# Altium project BTL_HW_V1.0.0.PrjPcb
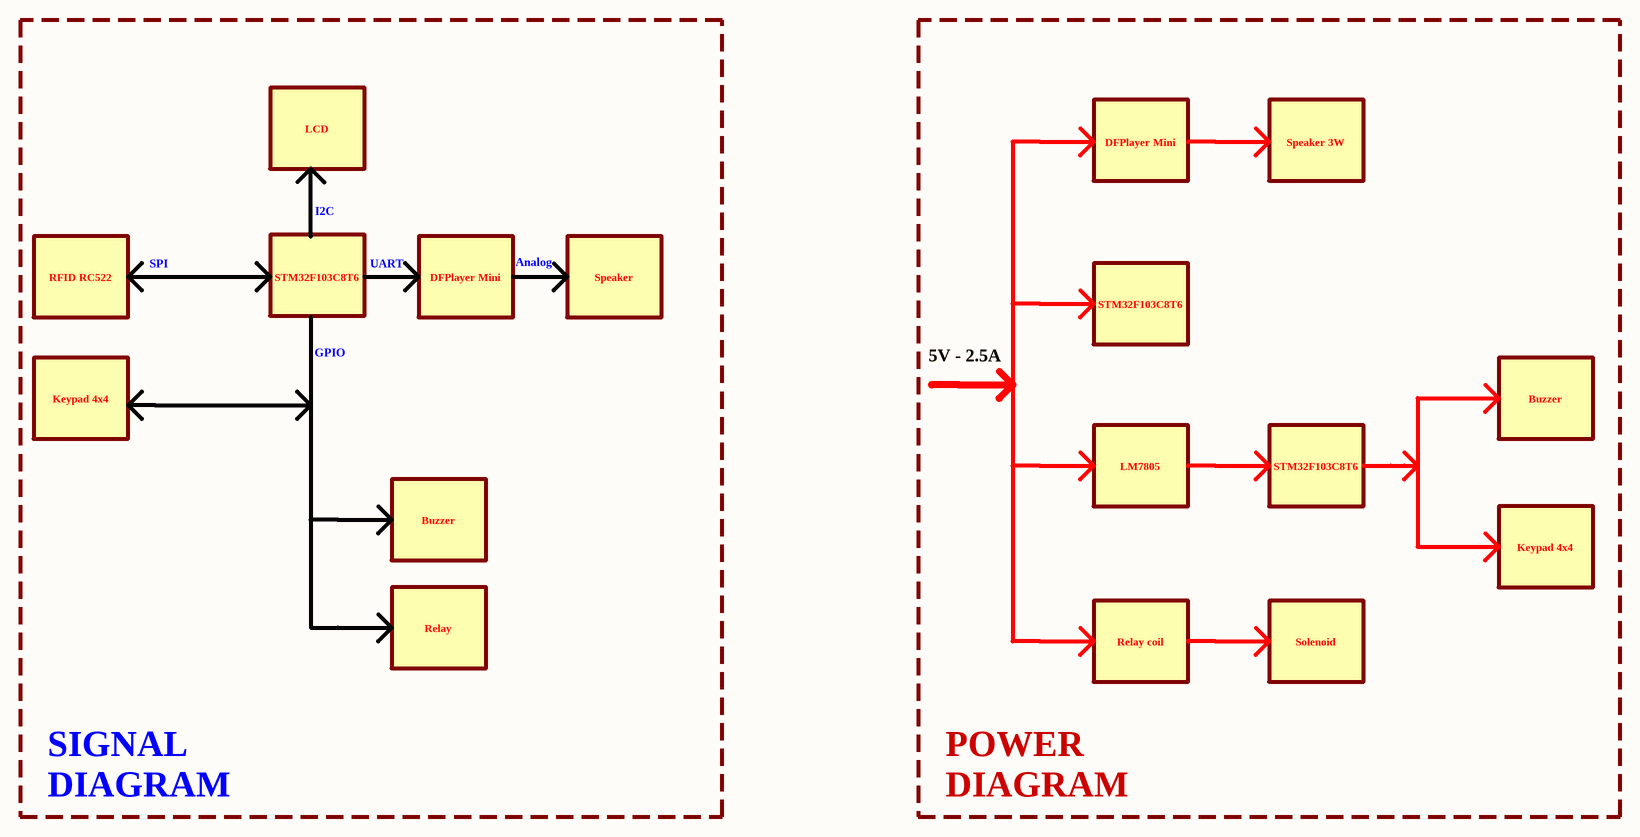
[diagram p0: Block_Diagram.SchDoc]
6 sheets, 61 parts. Net scope: flat (ports and power ports of the same name join across sheets).
Board file: HW_V1.0.0.PcbDoc
Sheets:
  Block_Diagram.SchDoc
  MCU.SchDoc
  RFID.SchDoc
  Relay.SchDoc
  POWER.SchDoc
  LCD.SchDoc

## Sheet Block_Diagram.SchDoc: Block_Diagram
size 420 x 297 mm; DrawnBy: Linh Vu; SheetNumber: 1; SheetTotal: 6; MasterProject: BTL_TKHTN

### Notes on the sheet
- LCD
- 620mA
- 5V
- DFPlayer Mini
- 600mA
- Speaker 3W
- I2C
- RFID RC522
- SPI
- STM32F103C8T6
- UART
- Analog
- Speaker
- GPIO
- 30mA
- Keypad 4x4
- 5V - 2.5A
- 3V3
- 2mA
- Buzzer
- 45mA
- LM7805
- 6mA
- Relay
- 1300mA
- Relay coil
- 1000mA
- Solenoid
- SIGNAL
  DIAGRAM
- POWER
  DIAGRAM
- Sub-system:
- Project:
- Design by:
- Sheet title:
- Sheet
- of
- Checked by:
- Approved by:
- Doc No:
- Revision:
- Size:
- Date:
- A3

## Sheet MCU.SchDoc: MCU
size 420 x 297 mm; DrawnBy: Hung Vo; SheetNumber: 2; SheetTotal: 6; MasterProject: BTL TKHTN
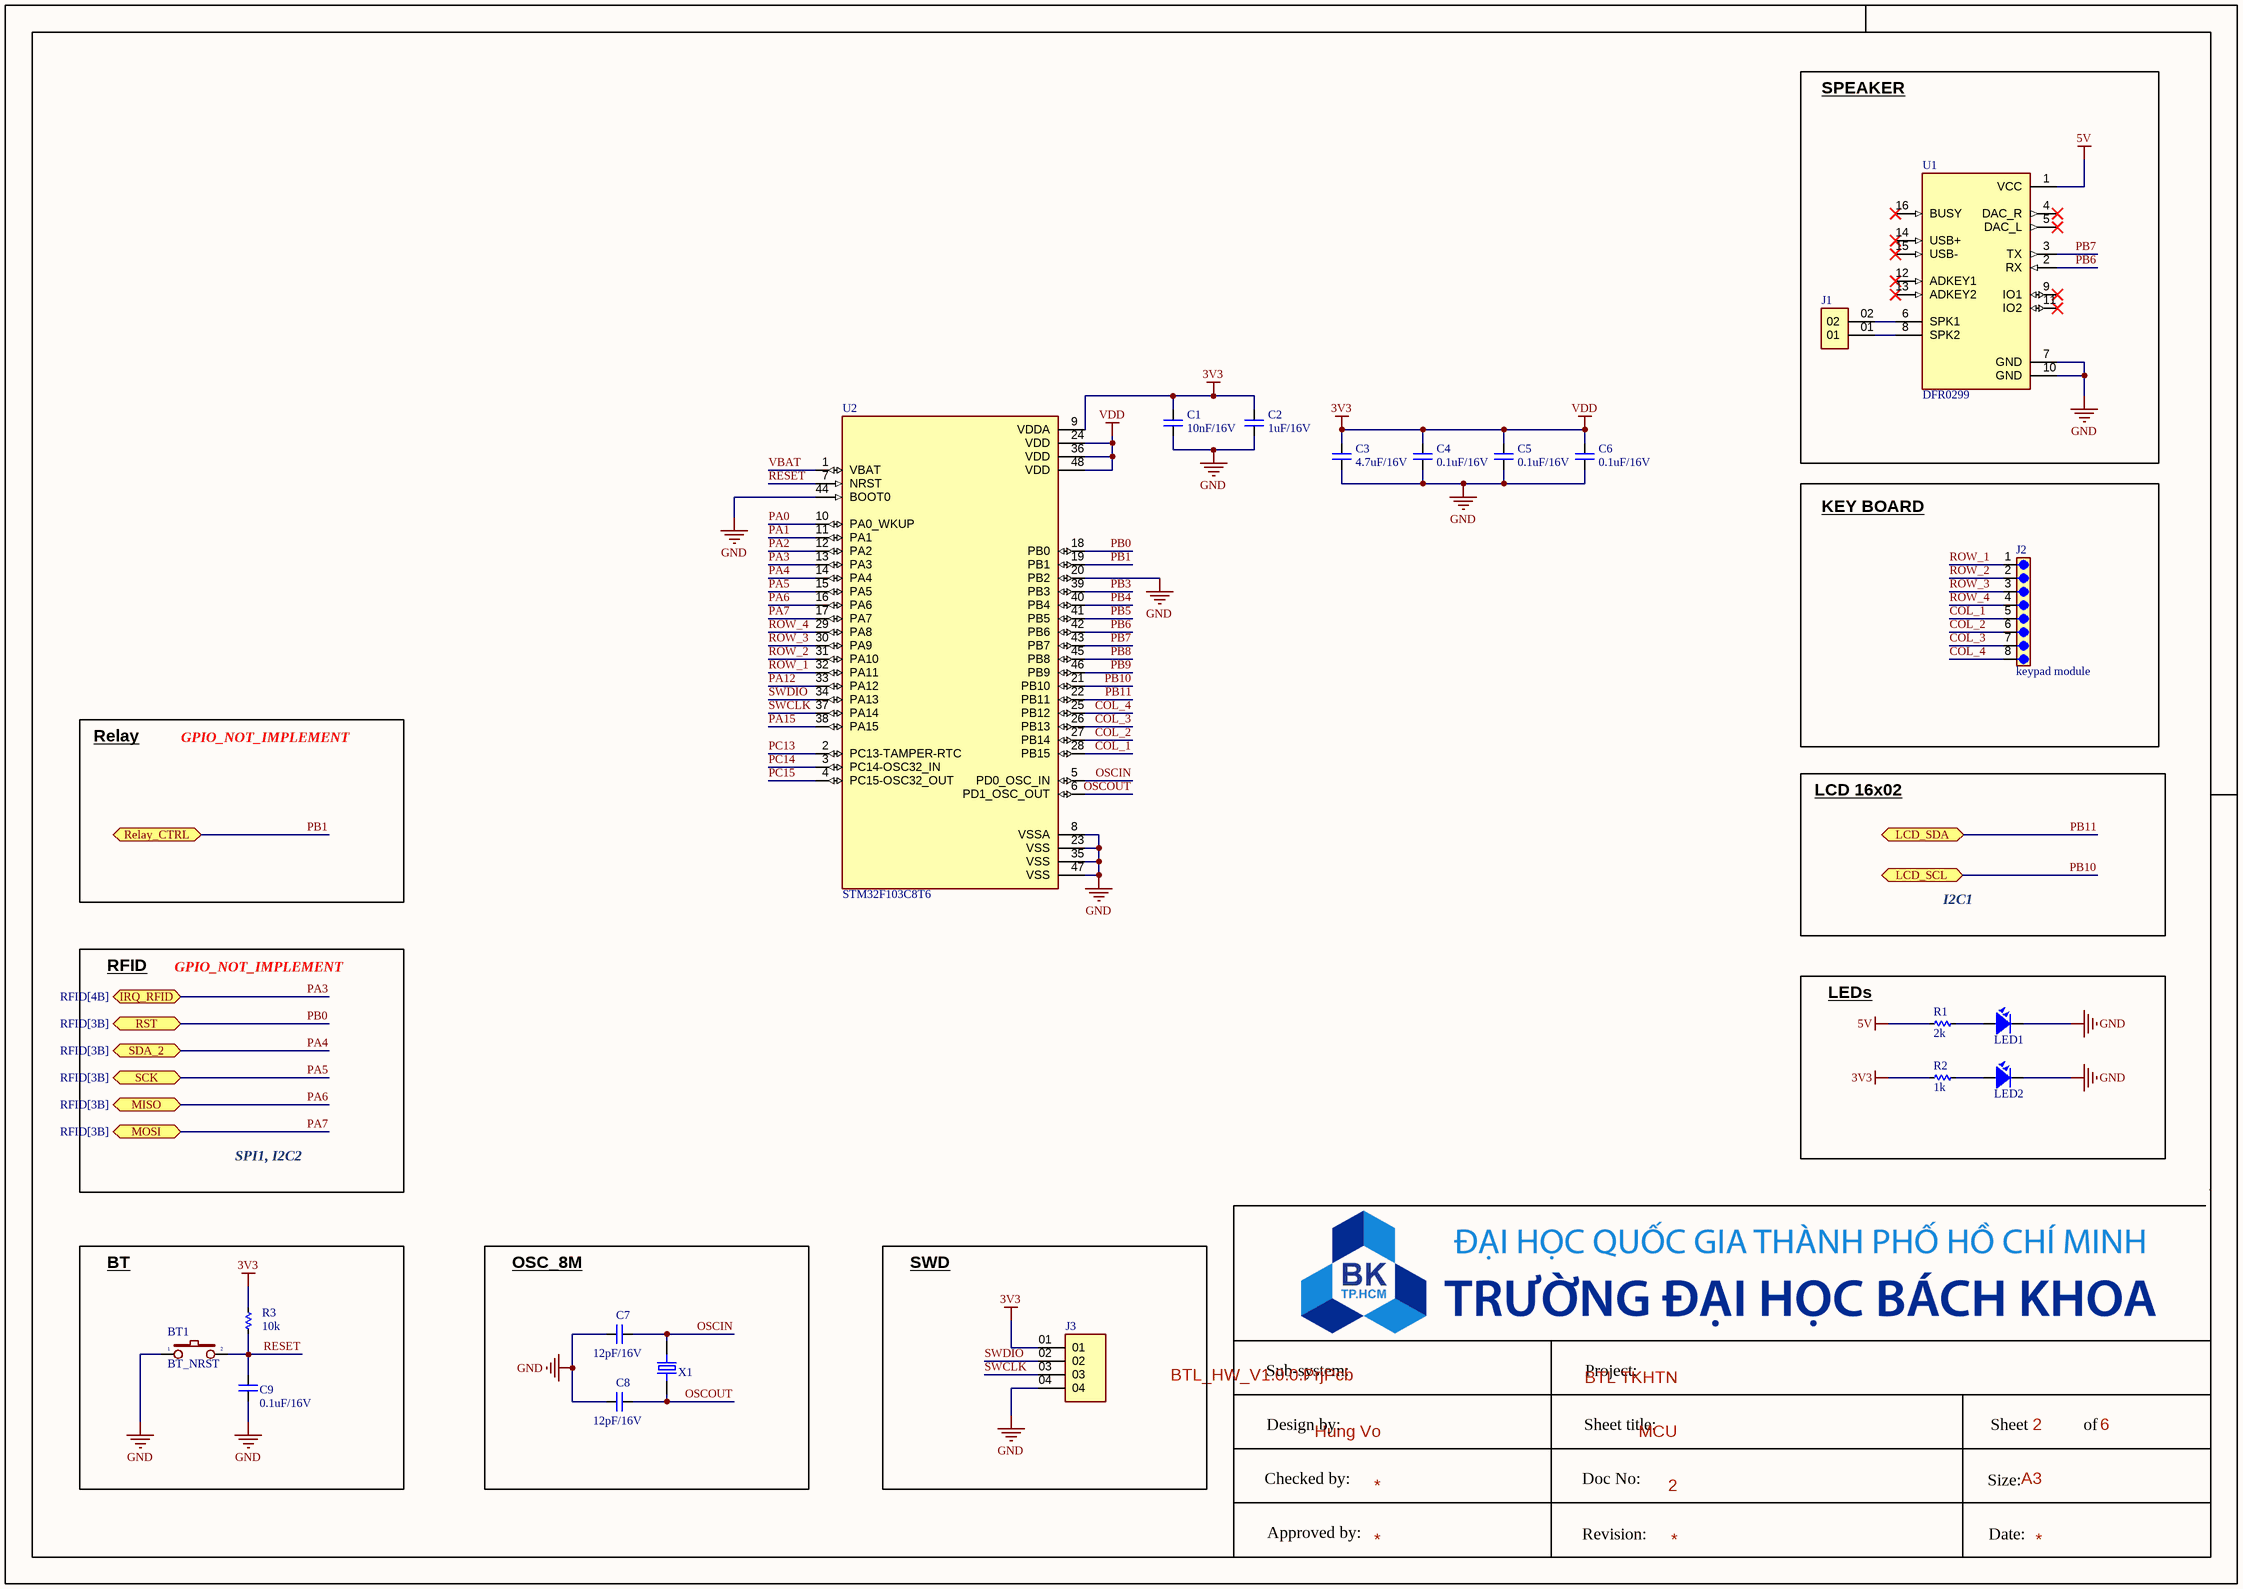
[diagram p1: MCU.SchDoc]

### Parts
BT1  BT_NRST  [SW2-SMD]
C1  10nF/16V  [CAP_C_1608X80]
C2  1uF/16V  [CAP_C_1608X80]
C3  4.7uF/16V  [CAP_C_1608X80]
C4  0.1uF/16V  [CAP_C_1608X80]
C5  0.1uF/16V  [CAP_C_1608X80]
C6  0.1uF/16V  [CAP_C_1608X80]
C7  12pF/16V  [CAP_C_1608X80]
C8  12pF/16V  [CAP_C_1608X80]
C9  0.1uF/16V  [CAP_C_1608X80]
J1  MTSW-102-08-G-S-100-RA  [SAMTEC_MTSW-102-08-G-S-100-RA]  (value not drawn)
J2  keypad module  [61300811121]
J3  HTSW-104-08-G-S-RA  [SAMTEC_HTSW-104-08-G-S-RA]  (value not drawn)
LED1  LED  [LED-0603-RED]  (value not drawn)
LED2  LED  [LED-0603-RED]  (value not drawn)
R1  2k  [RES_C_1608X60]
R2  1k  [RES_C_1608X60]
R3  10k  [RES_C_1608X60]
U1  DFR0299  [MODULE_DFR0299]
U2  STM32F103C8T6  [QFP50P900X900X160-48N]
X1  ECS-080-18-5PX-JES-TR  [XTAL 8MHz]  (value not drawn)

### Blocks framed on the sheet
SPEAKER: J1 U1
KEY BOARD: J2
LEDs: LED1 LED2 R1 R2
BT: BT1 C9 R3
OSC_8M: C7 C8 X1
SWD: J3

### Ports
IRQ_RFID (bidir, see RFID[4B]), LCD_SCL (bidir, see LCD[4B]), LCD_SDA (bidir, see LCD[4B]), MISO (bidir, see RFID[3B]), MOSI (bidir, see RFID[3B]), Relay_CTRL (bidir, see Relay[2B]), RST (bidir, see RFID[3B]), SCK (bidir, see RFID[3B]), SDA_2 (bidir, see RFID[3B])

### Nets
3V3: C1.2 C2.2 C3.2 C4.2 C5.2 C6.2 J3.01 R2.2 R3.2 U2.9(VDDA) U2.24(VDD) U2.36(VDD) U2.48(VDD)  [also labelled VDD]
5V: R1.2 U1.1(VCC)
GND: BT1.1 C1.1 C2.1 C3.1 C4.1 C5.1 C6.1 C7.1 C8.1 C9.1 J3.04 LED1.2 LED2.2 U1.7(GND) U1.10(GND) U2.8(VSSA) U2.20(PB2) U2.23(VSS) U2.35(VSS) U2.44(BOOT0) U2.47(VSS)
COL_1: J2.5 U2.28(PB15)
COL_2: J2.6 U2.27(PB14)
COL_3: J2.7 U2.26(PB13)
COL_4: J2.8 U2.25(PB12)
OSCIN: C7.2 U2.5(PD0_OSC_IN) X1.1
OSCOUT: C8.2 U2.6(PD1_OSC_OUT) X1.2
PA0: U2.10(PA0_WKUP)
PA1: U2.11(PA1)
PA2: U2.12(PA2)
PA3: U2.13(PA3) ; port IRQ_RFID
PA4: U2.14(PA4) ; port SDA_2
PA5: U2.15(PA5) ; port SCK
PA6: U2.16(PA6) ; port MISO
PA7: U2.17(PA7) ; port MOSI
PA12: U2.33(PA12)
PA15: U2.38(PA15)
PB0: U2.18(PB0) ; port RST
PB1: U2.19(PB1) ; port Relay_CTRL
PB3: U2.39(PB3)
PB4: U2.40(PB4)
PB5: U2.41(PB5)
PB6: U1.2(RX) U2.42(PB6)
PB7: U1.3(TX) U2.43(PB7)
PB8: U2.45(PB8)
PB9: U2.46(PB9)
PB10: U2.21(PB10) ; port LCD_SCL
PB11: U2.22(PB11) ; port LCD_SDA
PC13: U2.2(PC13-TAMPER-RTC)
PC14: U2.3(PC14-OSC32_IN)
PC15: U2.4(PC15-OSC32_OUT)
RESET: BT1.2 C9.2 R3.1 U2.7(NRST)
ROW_1: J2.1 U2.32(PA11)
ROW_2: J2.2 U2.31(PA10)
ROW_3: J2.3 U2.30(PA9)
ROW_4: J2.4 U2.29(PA8)
SWCLK: J3.03 U2.37(PA14)
SWDIO: J3.02 U2.34(PA13)
VBAT: U2.1(VBAT)
NetJ1_01: J1.01 U1.8(SPK2)
NetJ1_02: J1.02 U1.6(SPK1)
NetLED1_1: LED1.1 R1.1
NetLED2_1: LED2.1 R2.1

Not connected (* = marked no-connect by the designer): U1 4(DAC_R)* 5(DAC_L)* 9(IO1)* 11(IO2)* 12(ADKEY1)* 13(ADKEY2)* 14(USB+)* 15(USB-)* 16(BUSY)*

### Notes on the sheet
- Relay
- GPIO_NOT_IMPLEMENT
- LCD 16x02
- I2C1
- RFID
- SPI1, I2C2
- Sub-system:
- Project:
- Design by:
- Sheet title:
- Sheet
- of
- Checked by:
- Approved by:
- Doc No:
- Revision:
- Size:
- Date:
- A3

### Library data of the parts
BT1 = BT2: Switch button 2 pin; Value: SW chip 2 pin
C1-C9 = CAP_SMD: CAP_Chip; Value: 33pF
J1 = MTSW-102-08-G-S-100-RA: Connector Header Through Hole, Right Angle 2 position 0.100 (2.54mm); MF: Samtec; SnapEDA_Link: https://www.snapeda.com/parts/MTSW-102-08-G-S-100-RA/Samtec/view-part/?ref=snap; Package: None; Value: *; MP: MTSW-102-08-G-S-100-RA; Check_prices: https://www.snapeda.com/parts/MTSW-102-08-G-S-100-RA/Samtec/view-part/?ref=eda
J2 = keypad module: 8 pins, 1 row, straight, gold plating; MF: Wurth Electronics; SnapEDA_Link: https://www.snapeda.com/parts/61300811121/Wurth+Electronics/view-part/?ref=snap; Package: None; Value: *; MP: 61300811121; Check_prices: https://www.snapeda.com/parts/61300811121/Wurth+Electronics/view-part/?ref=eda
J3 = HTSW-104-08-G-S-RA: MF: Samtec; MP: HTSW-104-08-G-S-RA; Package: None; Availability: Unavailable; Value: *; Price: None
LED1 LED2 = LED SMD: Value: LED 3 - 5 ly 2 Colour
R1-R3 = RES_SMD: RES
U1 = DFR0299: - MP3 Player Audio Arduino Platform Evaluation Expansion Board; MF: DFRobot; SnapEDA_Link: https://www.snapeda.com/parts/DFR0299/DFRobot/view-part/?ref=snap; Package: None; Value: *; MP: DFR0299; Check_prices: https://www.snapeda.com/parts/DFR0299/DFRobot/view-part/?ref=eda
U2 = STM32F103C8T6: ARM® Cortex®-M3 STM32F1 Microcontroller IC 32-Bit 72MHz 64KB (64K x 8) FLASH 48-LQFP (7x7); MF: STMicroelectronics; SnapEDA_Link: https://www.snapeda.com/parts/STM32F103C8T6/STMicroelectronics/view-part/?ref=snap; Package: LQFP-48 STMicroelectronics; Value: *; MP: STM32F103C8T6; Check_prices: https://www.snapeda.com/parts/STM32F103C8T6/STMicroelectronics/view-part/?ref=eda
X1 = ECS-080-18-5PX-JES-TR: 8 MHz Â±20ppm Crystal 18pF 60 Ohms HC-49/US; MF: ECS Inc.; SnapEDA_Link: https://www.snapeda.com/parts/ECS-080-18-5PX-JES-TR/ECS/view-part/?ref=snap; Package: CSM-7X-3L-5G3X-2 ECS; Value: *; MP: ECS-080-18-5PX-JES-TR; Check_prices: https://www.snapeda.com/parts/ECS-080-18-5PX-JES-TR/ECS/view-part/?ref=eda

## Sheet RFID.SchDoc: RFID
size 420 x 297 mm; DrawnBy: Hung Vo; SheetNumber: 3; SheetTotal: 6; MasterProject: BTL TKHTN
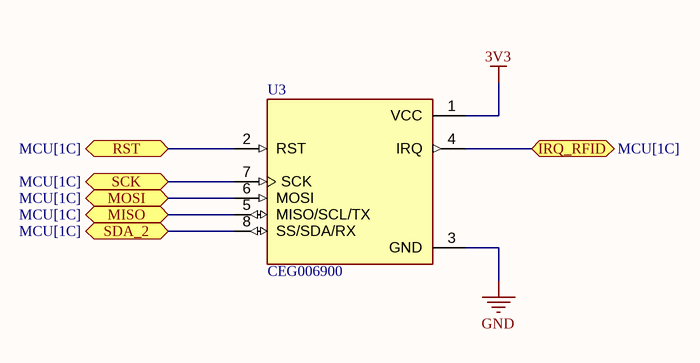
[diagram p2: RFID.SchDoc]

### Parts
U3  CEG006900  [MODULE_CEG006900]

### Ports
IRQ_RFID (bidir, see MCU[1C]), MISO (bidir, see MCU[1C]), MOSI (bidir, see MCU[1C]), RST (bidir, see MCU[1C]), SCK (bidir, see MCU[1C]), SDA_2 (bidir, see MCU[1C])

### Nets
3V3: U3.1(VCC)
GND: U3.3(GND)
PA3: U3.4(IRQ) ; port IRQ_RFID
PA4: U3.8(SS/SDA/RX) ; port SDA_2
PA5: U3.7(SCK) ; port SCK
PA6: U3.5(MISO/SCL/TX) ; port MISO
PA7: U3.6(MOSI) ; port MOSI
PB0: U3.2(RST) ; port RST

### Notes on the sheet
- Sub-system:
- Project:
- Design by:
- Sheet title:
- Sheet
- of
- Checked by:
- Approved by:
- Doc No:
- Revision:
- Size:
- Date:
- A3

### Library data of the parts
U3 = CEG006900: RFID RC522 Reader IC Card Module Tags SPI Interface Read and Write; MF: YKS; Value: *; SnapEDA_Link: https://www.snapeda.com/parts/CEG006900/YKS/view-part/?ref=snap; MP: CEG006900; Check_prices: https://www.snapeda.com/parts/CEG006900/YKS/view-part/?ref=eda; Availability: Not in stock; Price: None; Package: None

## Sheet Relay.SchDoc: RELAY
size 420 x 297 mm; DrawnBy: Hung Vo; SheetNumber: 4; SheetTotal: 6; MasterProject: BTL TKHTN
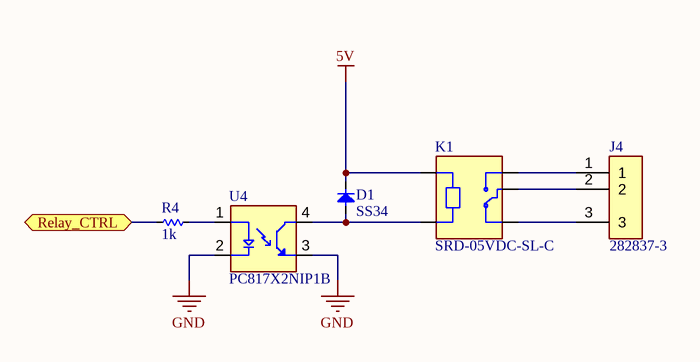
[diagram p3: Relay.SchDoc]

### Parts
D1  SS34  [DO-214AC_SMA]
J4  282837-3  [TE_282837-3]
K1  SRD-05VDC-SL-C  [RELAY_SRD-05VDC-SL-C]
R4  1k  [RES_C_1608X60]
U4  PC817X2NIP1B  [SOIC254P960X420-4N]

### Ports
Relay_CTRL (bidir, see MCU[1C])

### Nets
5V: D1.1(K) K1.A1
GND: U4.2(C) U4.3(ET)
PB1: R4.1 ; port Relay_CTRL
NetD1_2: D1.2(A) K1.A2 U4.4(CT)
NetJ4_1: J4.1 K1.NO
NetJ4_2: J4.2 K1.COM
NetJ4_3: J4.3 K1.NC
NetR4_2: R4.2 U4.1(A)

### Notes on the sheet
- Sub-system:
- Project:
- Design by:
- Sheet title:
- Sheet
- of
- Checked by:
- Approved by:
- Doc No:
- Revision:
- Size:
- Date:
- A3

### Library data of the parts
D1 = Diode SMD: Default Diode; Code - JEDEC: DO-214-AB; Value: 1N5007; Published: 8-Jun-2000; Revision: July-2002: Re-released for DXP Platform.; Publisher: Altium Limited
J4 = 282837-3: TERMI-BLOK PCB MOUNT 3P; Availability: Unavailable; Package: None; MP: 282837-3; Value: *; Price: None
K1 = SRD-05VDC-SL-C: 5V Trigger Relay Module For Arduino And Raspberry Pi 5V Trigger Relay Module For Arduino And Raspberry Pi; MF: Songle Relay; Check_prices: https://www.snapeda.com/parts/SRD-05VDC-SL-C/Songle+Relay/view-part/?ref=eda; Value: *; Availability: Not in stock; Price: None; Package: NON STANDARD-5 Songle Relay; MP: SRD-05VDC-SL-C; SnapEDA_Link: https://www.snapeda.com/parts/SRD-05VDC-SL-C/Songle+Relay/view-part/?ref=snap
R4 = RES_SMD: RES
U4 = PC817X2NIP1B: Optocoupler DC-IN 1-CH Transistor DC-OUT 4-Pin DIP SMD T/R; MF: Sharp Microelectronics; SnapEDA_Link: https://www.snapeda.com/parts/PC817X2NIP1B/Sharp+Microelectronics/view-part/?ref=snap; Package: SMD-4 Sharp Microelectronics; Value: *; MP: PC817X2NIP1B; Check_prices: https://www.snapeda.com/parts/PC817X2NIP1B/Sharp+Microelectronics/view-part/?ref=eda

## Sheet POWER.SchDoc: POWER
size 420 x 297 mm; DrawnBy: Hung Vo; SheetNumber: 5; SheetTotal: 6; MasterProject: BTL TKHTN
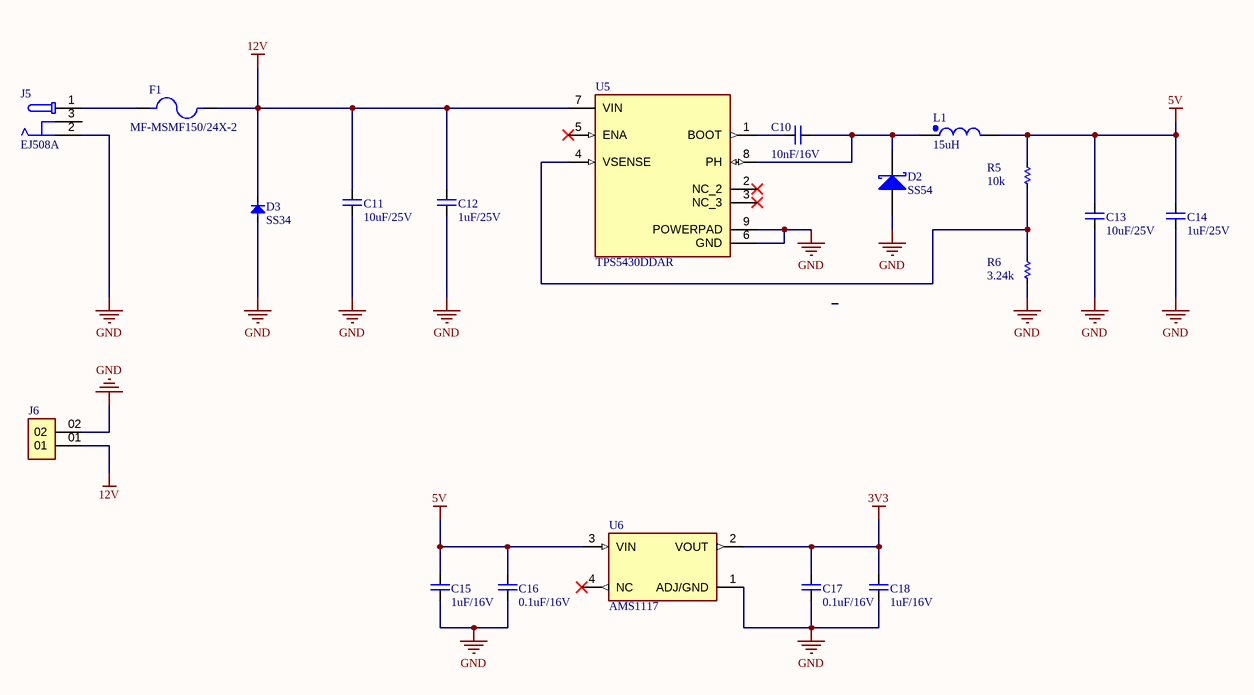
[diagram p4: POWER.SchDoc]

### Parts
C10  10nF/16V  [CAP_C_1608X80]
C11  10uF/25V  [CAP_C_1608X80]
C12  1uF/25V  [CAP_C_1608X80]
C13  10uF/25V  [CAP_C_1608X80]
C14  1uF/25V  [CAP_C_1608X80]
C15  1uF/16V  [CAP_C_1608X80]
C16  0.1uF/16V  [CAP_C_1608X80]
C17  0.1uF/16V  [CAP_C_1608X80]
C18  1uF/16V  [CAP_C_1608X80]
D2  SS54  [DO-214AC_SMA]
D3  SS34  [DO-214AC_SMA]
F1  MF-MSMF150/24X-2  [FUSER_MF-MSMF150/24X-2]
J5  EJ508A  [MPD_EJ508A]
J6  MTSW-102-08-G-S-100-RA  [SAMTEC_MTSW-102-08-G-S-100-RA]  (value not drawn)
L1  15uH  [IND_CDRH127/LDNP-470MC_SUM]
R5  10k  [RES_C_1608X60]
R6  3.24k  [RES_C_1608X60]
U5  TPS5430DDAR  [CONV_TPS5430DDAR]
U6  AMS1117  [SOT229P700X180-4N]

### Nets
3V3: C17.2 C18.2 U6.2(VOUT)
5V: C13.2 C14.2 C15.2 C16.2 L1.2 R5.1 U6.3(VIN)
12V: C11.2 C12.2 D3.1(K) F1.2 J6.01 U5.7(VIN)
GND: C11.1 C12.1 C13.1 C14.1 C15.1 C16.1 C17.1 C18.1 D2.1(A) D3.2(A) J5.2 J6.02 R6.2 U5.6(GND) U5.9(POWERPAD) U6.1(ADJ/GND)
NetC10_1: C10.1 D2.2(K) L1.1 U5.8(PH)
NetC10_2: C10.2 U5.1(BOOT)
NetF1_1: F1.1 J5.1
NetR5_2: R5.2 R6.1 U5.4(VSENSE)

Not connected (* = marked no-connect by the designer): J5 3; U5 2(NC_2)* 3(NC_3)* 5(ENA)*; U6 4(NC)*

### Notes on the sheet
- Sub-system:
- Project:
- Design by:
- Sheet title:
- Sheet
- of
- Checked by:
- Approved by:
- Doc No:
- Revision:
- Size:
- Date:
- A3

### Library data of the parts
C10-C18 = CAP_SMD: CAP_Chip; Value: 33pF
D2 = SS54: DIODE SCHOTTKY 40V 5A SMA; MPN: SS34; Solder: SMT; Value: SS34; MFR: *
D3 = Diode SMD: as D1 on sheet Relay; Published: 8-Jun-2000; Revision: July-2002: Re-released for DXP Platform.; Publisher: Altium Limited
F1 = MF-MSMF150/24X-2: Polymeric PTC Resettable Fuse 24V 1.5 A Ih Surface Mount 1812 (4532 Metric), Concave; MF: Bourns; Check_prices: https://www.snapeda.com/parts/MF-MSMF150/24X-2/Bourns/view-part/?ref=eda; Value: *; MP: MF-MSMF150/24X-2; Purchase-URL: https://pricing.snapeda.com/search/part/MF-MSMF150/24X-2/?ref=eda; SnapEDA_Link: https://www.snapeda.com/parts/MF-MSMF150/24X-2/Bourns/view-part/?ref=snap; Package: 1812 Bourns; Digi-Key_Part_Number: MF-MSMF150/24X-2TR-ND
J5 = EJ508A: Power Barrel Connector Jack 2.10mm ID _0.083_, 5.50mm OD _0.217_ Through Hole, Right Angle; MF: MPD; Package: Non-Standard MPD; Value: *; SnapEDA_Link: https://www.snapeda.com/parts/EJ508A/MPD%20%28Memory%20Protection%20Devices%29/view-part/474399/?ref=snap; Price: None; MP: EJ508A; Availability: Unavailable
J6 = MTSW-102-08-G-S-100-RA: as J1 on sheet MCU; SnapEDA_Link: https://www.snapeda.com/parts/MTSW-102-08-G-S-100-RA/Samtec/view-part/?ref=snap; Package: None; Value: *; MP: MTSW-102-08-G-S-100-RA; Check_prices: https://www.snapeda.com/parts/MTSW-102-08-G-S-100-RA/Samtec/view-part/?ref=eda
L1 = _IND
R5 R6 = _RES_B_2: RES
U5 = TPS5430DDAR: 5.5V to 36V Input, 3A, 500kHz Step-Down Converter; MF: Texas Instruments; Package: HSOIC-8 Texas Instruments; Check_prices: https://www.snapeda.com/parts/TPS5430DDAR/Texas+Instruments/view-part/?ref=eda; Value: *; Purchase-URL: https://pricing.snapeda.com/search/part/TPS5430DDAR/?ref=eda; Availability: In Stock; SnapEDA_Link: https://www.snapeda.com/parts/TPS5430DDAR/Texas+Instruments/view-part/?ref=snap; MP: TPS5430DDAR; Price: None
U6 = AMS1117: 1A LOW DROPOUT VOLTAGE REGULATOR SOT-223; MF: Advanced Monolithic Systems; SnapEDA_Link: https://www.snapeda.com/parts/AMS1117/Advanced+Monolithic+Systems/view-part/?ref=snap; Package: SOT-223 Seeed Technology; Value: *; MP: AMS1117; Check_prices: https://www.snapeda.com/parts/AMS1117/Advanced+Monolithic+Systems/view-part/?ref=eda

## Sheet LCD.SchDoc
size 420 x 297 mm; SheetNumber: 6; SheetTotal: 6
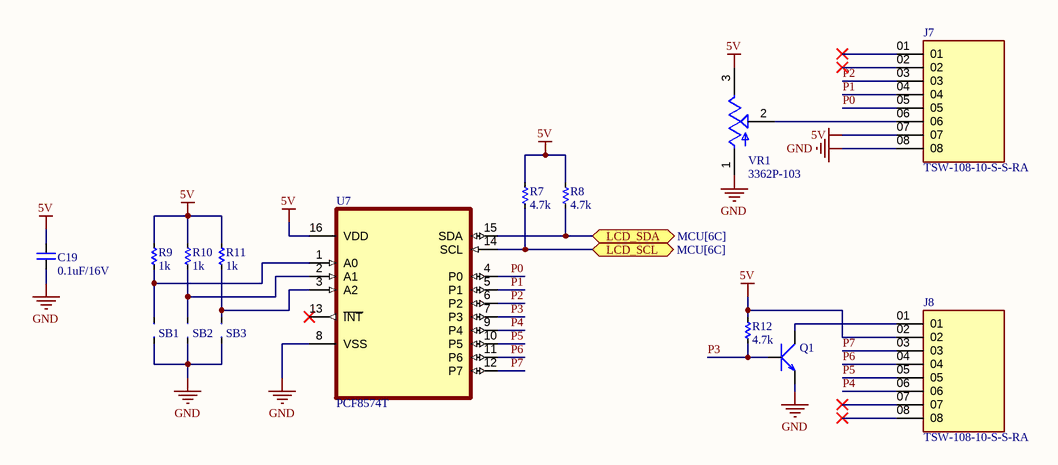
[diagram p5: LCD.SchDoc]

### Parts
C19  0.1uF/16V  [CAP_C_1608X80]
J7  TSW-108-10-S-S-RA  [SAMTEC_TSW-108-10-S-S-RA]
J8  TSW-108-10-S-S-RA  [SAMTEC_TSW-108-10-S-S-RA]
Q1  SMD-TRANSISTORS-NPN-25V-500MW(SOT-23)  [SOT-23]  (value not drawn)
R7  4.7k  [RES_C_1608X60]
R8  4.7k  [RES_C_1608X60]
R9  1k  [RES_C_1608X60]
R10  1k  [RES_C_1608X60]
R11  1k  [RES_C_1608X60]
R12  4.7k  [RES_C_1608X60]
SB1  JUMPER  [JUMPER_1608]  (value not drawn)
SB2  JUMPER  [JUMPER_1608]  (value not drawn)
SB3  JUMPER  [JUMPER_1608]  (value not drawn)
U7  PCF8574T  [SOIC127P1032X265-16N]
VR1  3362P-103  [TRIM_3362P-103]

### Ports
LCD_SCL (bidir, see MCU[6C]), LCD_SDA (bidir, see MCU[6C])

### Nets
5V: C19.2 J7.07 J8.02 R7.2 R8.2 R9.2 R10.2 R11.2 R12.2 U7.16(VDD) VR1.3(CW)
GND: C19.1 J7.08 Q1.2(E) SB1.1 SB2.1 SB3.1 U7.8(VSS) VR1.1(CCW)
P0: J7.05 U7.4(P0)
P1: J7.04 U7.5(P1)
P2: J7.03 U7.6(P2)
P3: Q1.1(B) R12.1 U7.7(P3)
P4: J8.06 U7.9(P4)
P5: J8.05 U7.10(P5)
P6: J8.04 U7.11(P6)
P7: J8.03 U7.12(P7)
PB10: R7.1 U7.14(SCL) ; port LCD_SCL
PB11: R8.1 U7.15(SDA) ; port LCD_SDA
NetJ7_06: J7.06 VR1.2(WIPER)
NetJ8_01: J8.01 Q1.3(C)
NetR9_1: R9.1 SB1.2 U7.1(A0)
NetR10_1: R10.1 SB2.2 U7.2(A1)
NetR11_1: R11.1 SB3.2 U7.3(A2)

Not connected (* = marked no-connect by the designer): J7 01* 02*; J8 07* 08*; U7 13(~{INT})*

### Notes on the sheet
- Sub-system:
- Project:
- Design by:
- Sheet title:
- Sheet
- of
- Checked by:
- Approved by:
- Doc No:
- Revision:
- Size:
- Date:
- A3

### Library data of the parts
C19 = CAP_SMD: CAP_Chip; Value: 33pF
J7 J8 = TSW-108-10-S-S-RA: Connector Header Through Hole, Right Angle 8 position 0.100 (2.54mm); MF: Samtec; SnapEDA_Link: https://www.snapeda.com/parts/TSW-108-10-S-S-RA/Samtec/view-part/?ref=snap; Package: None; Value: *; MP: TSW-108-10-S-S-RA; Check_prices: https://www.snapeda.com/parts/TSW-108-10-S-S-RA/Samtec/view-part/?ref=eda
Q1 = SMD-TRANSISTORS-NPN-25V-500MW(SOT-23): Bipolar (BJT) Transistor NPN 25 V 500 mA 150MHz 300 mW Surface Mount SOT-23; MF: UMW; MP: S8050; Purchase-URL: https://pricing.snapeda.com/search/part/S8050/?ref=eda; Check_prices: https://www.snapeda.com/parts/S8050/Umwelt+Sensor+Teknik/view-part/?ref=eda; SnapEDA_Link: https://www.snapeda.com/parts/S8050/Umwelt+Sensor+Teknik/view-part/?ref=snap; Price: None; Availability: In Stock; Package: None; Value: *
R7-R12 = RES_SMD: RES
U7 = PCF8574T: I/O Expander 8 IÂ²C 100 kHz 20-SSOP; MF: NXP Semiconductors; MP: PCF8574T; Price: None; Availability: In Stock; Package: SOIC-16 NXP Semiconductors; Purchase-URL: https://pricing.snapeda.com/search/part/PCF8574T/?ref=eda; SnapEDA_Link: https://www.snapeda.com/parts/PCF8574T/NXP+Semiconductors/view-part/?ref=snap; Value: *; Check_prices: https://www.snapeda.com/parts/PCF8574T/NXP+Semiconductors/view-part/?ref=eda
VR1 = 3362P-103: 10 kOhms 0.5W, 1/2W PC Pins Through Hole Trimmer Potentiometer Cermet 1 Turn Top Finger Adjustment; MF: Bourns; SnapEDA_Link: https://www.snapeda.com/parts/3362P-103/Bourns/view-part/?ref=snap; Package: 3362P-1 Bourns Inc.; Value: *; MP: 3362P-103; Check_prices: https://www.snapeda.com/parts/3362P-103/Bourns/view-part/?ref=eda

## Nets that join several sheets
3V3: MCU (13 pins), RFID (U3.1), POWER (C17.2 C18.2 U6.2)
5V: MCU (R1.2 U1.1), Relay (D1.1 K1.A1), POWER (7 pins), LCD (11 pins)
GND: MCU (21 pins), RFID (U3.3), Relay (U4.2 U4.3), POWER (16 pins), LCD (8 pins)
PA3: MCU (U2.13), RFID (U3.4)
PA4: MCU (U2.14), RFID (U3.8)
PA5: MCU (U2.15), RFID (U3.7)
PA6: MCU (U2.16), RFID (U3.5)
PA7: MCU (U2.17), RFID (U3.6)
PB0: MCU (U2.18), RFID (U3.2)
PB1: MCU (U2.19), Relay (R4.1)
PB10: MCU (U2.21), LCD (R7.1 U7.14)
PB11: MCU (U2.22), LCD (R8.1 U7.15)